# Altium project LDP_PWR_V2.0.PrjPcb
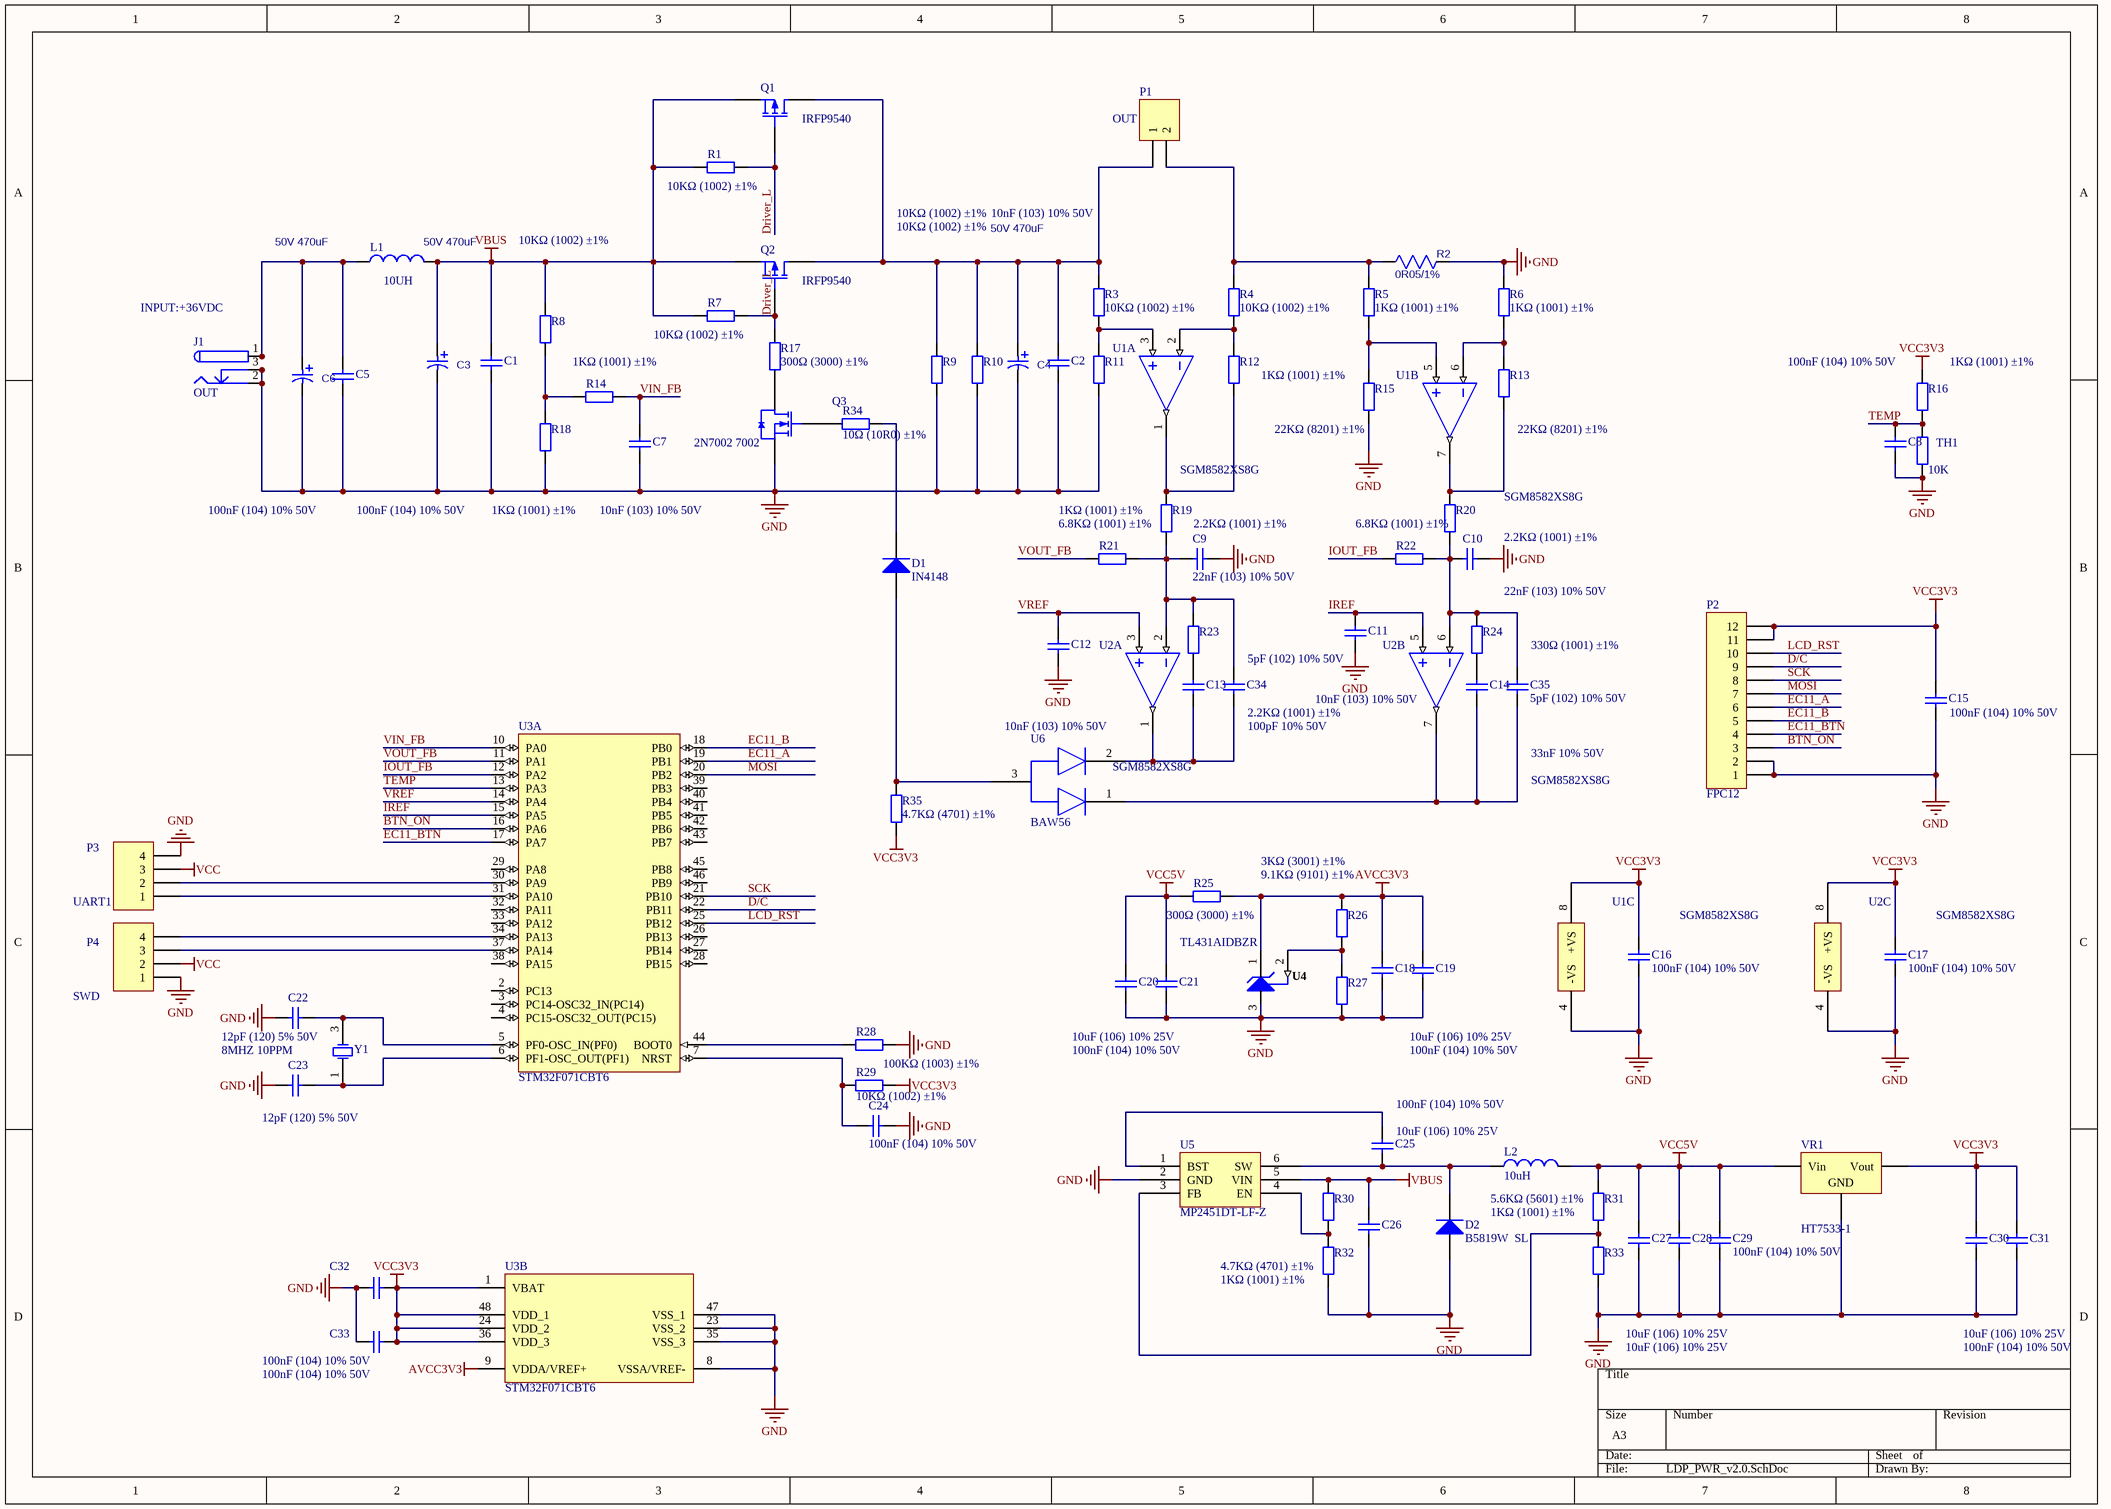
[diagram p0: LDP_PWR_v2.0.SchDoc]
1 sheet, 91 parts. Net scope: global (net labels, ports and power ports of the same name join across sheets).
Board file: LDP_PWR_V2.0.PcbDoc

## Sheet LDP_PWR_v2.0.SchDoc
size A3

### Parts
C1  100nF (104) 10% 50V  [0603_C]
C2  10nF (103) 10% 50V  [0603_C]
C3  50V 470uF  [CAP/DIP/10-5]
C4  50V 470uF  [CAP/DIP/10-5]
C5  100nF (104) 10% 50V  [0603_C]
C6  50V 470uF  [CAP/DIP/10-5]
C7  10nF (103) 10% 50V  [0603_C]
C8  100nF (104) 10% 50V  [0603_C]
C9  22nF (103) 10% 50V  [0603_C]
C10  22nF (103) 10% 50V  [0603_C]
C11  10nF (103) 10% 50V  [0603_C]
C12  10nF (103) 10% 50V  [0603_C]
C13  100pF 10% 50V  [0603_C]
C14  33nF 10% 50V  [0603_C]
C15  100nF (104) 10% 50V  [0603_C]
C16  100nF (104) 10% 50V  [0603_C]
C17  100nF (104) 10% 50V  [0603_C]
C18  10uF (106) 10% 25V  [0805_C]
C19  100nF (104) 10% 50V  [0603_C]
C20  10uF (106) 10% 25V  [0805_C]
C21  100nF (104) 10% 50V  [0603_C]
C22  12pF (120) 5% 50V  [0603_C]
C23  12pF (120) 5% 50V  [0603_C]
C24  100nF (104) 10% 50V  [0603_C]
C25  100nF (104) 10% 50V  [0603_C]
C26  10uF (106) 10% 25V  [0805_C]
C27  10uF (106) 10% 25V  [0805_C]
C28  10uF (106) 10% 25V  [0805_C]
C29  100nF (104) 10% 50V  [0603_C]
C30  10uF (106) 10% 25V  [0805_C]
C31  100nF (104) 10% 50V  [0603_C]
C32  100nF (104) 10% 50V  [0603_C]
C33  100nF (104) 10% 50V  [0603_C]
C34  5pF (102) 10% 50V  [0603_C]
C35  5pF (102) 10% 50V  [0603_C]
D1  IN4148  [SOD-123]
D2  B5819W  SL  [SOD-123]
J1  OUT  [CH3.96]
L1  value 10UH  [L/DIP_6X25]  (hidden comment: Inductor)
L2  10uH  [CD43 - duplicate]
P1  OUT  [CH3.96]
P2  FPC12  [FPC_12]
P3  UART1  [HDR1X4]
P4  SWD  [HDR1X4]
Q1  IRFP9540  [TO-220(TO-220-3)]
Q2  IRFP9540  [TO-220(TO-220-3)]
Q3  2N7002 7002  [SOT-23(SOT-23-3)]
R1  10KΩ (1002) ±1%  [1206_R]
R2  value 0R05/1%  [2512_R]  (hidden comment: 0R05)
R3  10KΩ (1002) ±1%  [0603_R]
R4  10KΩ (1002) ±1%  [0603_R]
R5  1KΩ (1001) ±1%  [0603_R]
R6  1KΩ (1001) ±1%  [0603_R]
R7  10KΩ (1002) ±1%  [1206_R]
R8  10KΩ (1002) ±1%  [0603_R]
R9  10KΩ (1002) ±1%  [1206_R]
R10  10KΩ (1002) ±1%  [1206_R]
R11  1KΩ (1001) ±1%  [0603_R]
R12  1KΩ (1001) ±1%  [0603_R]
R13  22KΩ (8201) ±1%  [0603_R]
R14  1KΩ (1001) ±1%  [0603_R]
R15  22KΩ (8201) ±1%  [0603_R]
R16  1KΩ (1001) ±1%  [0603_R]
R17  300Ω (3000) ±1%  [1206_R]
R18  1KΩ (1001) ±1%  [0603_R]
R19  2.2KΩ (1001) ±1%  [0603_R]
R20  2.2KΩ (1001) ±1%  [0603_R]
R21  6.8KΩ (1001) ±1%  [0603_R]
R22  6.8KΩ (1001) ±1%  [0603_R]
R23  2.2KΩ (1001) ±1%  [0603_R]
R24  330Ω (1001) ±1%  [0603_R]
R25  300Ω (3000) ±1%  [1206_R]
R26  3KΩ (3001) ±1%  [0603_R]
R27  9.1KΩ (9101) ±1%  [0603_R]
R28  100KΩ (1003) ±1%  [0603_R]
R29  10KΩ (1002) ±1%  [0603_R]
R30  4.7KΩ (4701) ±1%  [0603_R]
R31  5.6KΩ (5601) ±1%  [0603_R]
R32  1KΩ (1001) ±1%  [0603_R]
R33  1KΩ (1001) ±1%  [0603_R]
R34  10Ω (10R0) ±1%  [0603_R]
R35  4.7KΩ (4701) ±1%  [0603_R]
TH1  value 10K  [NTC_2.5MM]  (hidden comment: NTC 10K)
U1  SGM8582XS8G  [SOIC-8_208mil]  (parts A,B,C of 3)
U2  SGM8582XS8G  [SOIC-8_208mil]  (parts A,B,C of 3)
U3  STM32F071CBT6  [STM-LQFP48_N]  (parts A,B of 2)
U4  TL431AIDBZR  [TI-DBZ3_N]
U5  MP2451DT-LF-Z  [SOT-23-6]
U6  BAW56  [SOT-23(SOT-23-3)]
VR1  HT7533-1  [SOT-89(SOT-89-3)]
Y1  8MHZ 10PPM  [SMD-3225_4P]

### Nets
AVCC3V3: C18.2 C19.2 R25.2 R26.2 U3.9(VDDA/VREF+) U4.1(CATHODE)
GND: C1.1 C2.2 C3.2 C4.2 C5.1 C6.2 C7.1 C8.1 C9.1 C10.1 C11.2 C12.2 C15.1 C16.1 C17.1 C18.1 C19.1 C20.1 C21.1 C22.1 C23.1 C24.2 C26.1 C27.1 C28.1 C29.1 C30.1 C31.1 C32.2 C33.2 D2.1(A) J1.2 J1.2A J1.2B J1.3 J1.3A J1.3B P2.1 P2.2 P3.4 P4.1 Q3.2(S) R2.1 R6.2 R9.1 R10.1 R11.1 R15.1 R18.1 R27.1 R28.2 R32.1 R33.1 TH1.1 U1.4(-VS) U2.4(-VS) U3.8(VSSA/VREF-) U3.23(VSS_2) U3.35(VSS_3) U3.47(VSS_1) U4.3(ANODE) U5.2(GND) VR1.1(GND)
VBUS: C1.2 C3.1 C26.2 L1.2 Q1.3(S) Q2.3(S) R1.1 R7.1 R8.2 R30.2 U5.5(VIN)
VCC: P3.3 P4.2
VCC3V3: C15.2 C16.2 C17.2 C30.2 C31.2 C32.1 C33.1 P2.11 P2.12 R16.2 R29.2 R35.1 U1.8(+VS) U2.8(+VS) U3.1(VBAT) U3.24(VDD_2) U3.36(VDD_3) U3.48(VDD_1) VR1.3(Vout)
VCC5V: C20.2 C21.2 C27.2 C28.2 C29.2 L2.2 R25.1 R31.2 VR1.2(Vin)
BTN_ON: P2.3 U3.16(PA6)
D/C: P2.9 U3.22(PB11)
Driver_L: Q1.2(G) Q2.2(G) R1.2 R7.2 R17.2
EC11_A: P2.6 U3.19(PB1)
EC11_B: P2.5 U3.18(PB0)
EC11_BTN: P2.4 U3.17(PA7)
IOUT_FB: R22.2 U3.12(PA2)
IREF: C11.1 U2.5(IN+) U3.15(PA5)
LCD_RST: P2.10 U3.25(PB12)
MOSI: P2.7 U3.20(PB2)
SCK: P2.8 U3.21(PB10)
TEMP: C8.2 R16.1 TH1.2 U3.13(PA3)
VIN_FB: C7.2 R14.1 U3.10(PA0)
VOUT_FB: R21.2 U3.11(PA1)
VREF: C12.1 U2.3(IN+) U3.14(PA4)
NetC2_1: C2.1 C4.1 P1.1 Q1.1(D) Q2.1(D) R3.2 R9.2 R10.2
NetC5_2: C5.2 C6.1 J1.1 J1.1B J1.2 L1.1
NetC9_2: C9.2 C34.2 R19.1 R21.1 R23.1 U2.2(IN-)
NetC10_2: C10.2 C35.2 R20.1 R22.1 R24.1 U2.6(IN-)
NetC13_1: C13.1 R23.2
NetC13_2: C13.2 C34.1 U2.1(OUT)
NetC14_1: C14.1 R24.2
NetC14_2: C14.2 C35.1 U2.7(OUT)
NetC22_2: C22.2 U3.5(PF0-OSC_IN(PF0)) Y1.3(OSC2)
NetC23_2: C23.2 U3.6(PF1-OSC_OUT(PF1)) Y1.1(OSC1)
NetC24_1: C24.1 R29.1 U3.7(NRST)
NetC25_1: C25.1 D2.2(K) L2.1 U5.6(SW)
NetC25_2: C25.2 U5.1(BST)
NetD1_1: D1.1(A) R35.2 U6.3
NetD1_2: D1.2(K) R34.2
NetP1_2: P1.2 R2.2 R4.2 R5.2
NetP3_1: P3.1 U3.31(PA10)
NetP3_2: P3.2 U3.30(PA9)
NetP4_3: P4.3 U3.37(PA14)
NetP4_4: P4.4 U3.34(PA13)
NetQ3_1: Q3.1(G) R34.1
NetQ3_3: Q3.3(D) R17.1
NetR3_1: R3.1 R11.2 U1.3(IN+)
NetR4_1: R4.1 R12.2 U1.2(IN-)
NetR5_1: R5.1 R15.2 U1.5(IN+)
NetR6_1: R6.1 R13.2 U1.6(IN-)
NetR8_1: R8.1 R14.2 R18.2
NetR12_1: R12.1 R19.2 U1.1(OUT)
NetR13_1: R13.1 R20.2 U1.7(OUT)
NetR26_1: R26.1 R27.2 U4.2(REF)
NetR28_1: R28.1 U3.44(BOOT0)
NetR30_1: R30.1 R32.2 U5.4(EN)
NetR31_1: R31.1 R33.2 U5.3(FB)

Not connected (* = marked no-connect by the designer): U3 2(PC13) 3(PC14-OSC32_IN(PC14)) 4(PC15-OSC32_OUT(PC15)) 26(PB13) 27(PB14) 28(PB15) 29(PA8) 32(PA11) 33(PA12) 38(PA15) 39(PB3) 40(PB4) 41(PB5) 42(PB6) 43(PB7) 45(PB8) 46(PB9); U6 1 2

### Notes on the sheet
- (near J1) INPUT:+36VDC

### Library data of the parts
C1 C5 C8 C15-C17 C19 C21 C24 C25 C29 C31-C33 = 0603 100nF (104) 10% 50V: 贴片电容; ComponentLink1Description: 供应商链接; ComponentLink1URL: http://www.szlcsc.com/product/details_15331.html; Package: 0603; Supplier: LC; SuppliersPartNumber: C14663
C2 C7 C9-C14 = 0603 10nF (103) 10% 50V: 贴片电容; ComponentLink1Description: 供应商链接; ComponentLink1URL: http://www.szlcsc.com/product/details_58143.html; Package: 0603; Supplier: LC; SuppliersPartNumber: C57112
C3 C4 C6 = 07.0686: Capacitor;400V;20%; Manufacturer: {Manufacturer}; Manufacturer P/N: {Manufacturer P/N}; Part_Name: EKXG401ELL470ML25S; Manufacture: Nippon Chemi-con; Value: 220uF; Pid: 2107; Out_Num: 0; Available_Num: 67; EPR_Note: 16*25脚距7.5; Note: 47uF/400V; Package: DIP; Part Number: 07.0686; Spec: Capacitor; Manufacture_PN: EKXG401ELL470ML25S; Stock_Num: 67
C18 C20 C26-C28 C30 = 0805 10uF (106) 10% 25V: 贴片电容; ComponentLink1Description: 供应商链接; ComponentLink1URL: http://www.szlcsc.com/product/details_16532.html; Package: 0805; Supplier: LC; SuppliersPartNumber: C15850
C22 C23 = 0603 12pF (120) 5% 50V: 贴片电容; ComponentLink1Description: 供应商链接; ComponentLink1URL: http://www.szlcsc.com/product/details_39506.html; Package: 0603; Supplier: LC; SuppliersPartNumber: C38523
C34 C35 = 0603 1nF (102) 10% 50V: 贴片电容; ComponentLink1Description: 供应商链接; ComponentLink1URL: http://www.szlcsc.com/product/details_1940.html; Package: 0603; Supplier: LC; SuppliersPartNumber: C1588
D1 = Diode: Default Diode; Published: 8-Jun-2000; LatestRevisionDate: 17-Jul-2002; LatestRevisionNote: Re-released for DXP Platform.; PackageVersion: Sep-1996; PackageReference: SMC; Publisher: Altium Limited; PackageDescription: DO-214-AB/SMC; 2 C-Bend Leads; Body 7.9 x 5.9 mm, inc. leads (LxW); Code_JEDEC: DO-214-AB
D2 = SOD-123 B5819W  SL: 肖特基二极管; ComponentLink1Description: 供应商链接; ComponentLink1URL: http://www.szlcsc.com/product/details_9093.html; Package: SOD-123; Supplier: LC; SuppliersPartNumber: C8598
J1 = PWR2.5: Low Voltage Power Supply Connector; Published: 17-Dec-2003; DatasheetDocument: 09-May-2002; Publisher: Altium Limited; ComponentLink1Description: Manufacturer Link; ComponentLink1URL: http://domino.kycon.com/internet/Products.html
L1 L2 = Inductor: Code_IEC: 1005; Published: 8-Jun-2000; LatestRevisionDate: 29-May-2009; LatestRevisionNote: IPC-7351 Footprint Added.; PackageReference: 0402-A; Publisher: Altium Limited; PackageDescription: Chip Inductor; Code_JEITA: 0402
  L2: Value: 10uH
P1 = Header 2: Header, 2-Pin; LatestRevisionDate: 17-Jul-2002; LatestRevisionNote: Re-released for DXP Platform.; Publisher: Altium Limited
P2 = Header 12: Header, 12-Pin; LatestRevisionDate: 17-Jul-2002; LatestRevisionNote: Re-released for DXP Platform.; Publisher: Altium Limited
P3 P4 = Header 4: Header, 4-Pin; LatestRevisionDate: 17-Jul-2002; LatestRevisionNote: Re-released for DXP Platform.; Publisher: Altium Limited
Q1 Q2 = MOSFET-P: P-Channel MOSFET; Published: 8-Jun-2000; LatestRevisionDate: 17-Jul-2002; LatestRevisionNote: Re-released for DXP Platform.; PackageVersion: 1995/1996; PackageReference: E3; Publisher: Altium Limited; PackageDescription: TO, Flat Index; 3 In-Line, Axial Leads; Body Dia. 4.6mm; Lead Dia. 0.5 mm (max)
Q3 = 2N7002 7002: MOS(场效应管); ComponentLink1Description: 供应商链接; ComponentLink1URL: http://www.szlcsc.com/product/details_9040.html; Package: SOT-23(SOT-23-3); Supplier: LC; SuppliersPartNumber: C8545
R1 R7 R9 R10 = 1206 10KΩ (1002) 1%: 贴片电阻; ComponentLink1Description: 供应商链接; ComponentLink1URL: http://www.szlcsc.com/product/details_18590.html; Package: 1206; Supplier: LC; SuppliersPartNumber: C17902
R2 = 06.0281: Film Resistor;5%;; Manufacturer: Yageo; Manufacturer P/N: 9C06031A1203FKHFT; Part_Name: 0603SAJ0102T5E; Pid: 1965; Out_Num: 0; Available_Num: 8849; Package: 0603; Distributor: Digikey; Distributor P/N: 311-120KHCT-ND; Part Number: 06.0281; Spec: Film Resistor; Manufacture_PN: 0603SAJ0102T5E; Stock_Num: 8849
R3 R4 R8 R29 = 0603 10KΩ (1002) 1%: 贴片电阻; ComponentLink1Description: 供应商链接; ComponentLink1URL: http://www.szlcsc.com/product/details_26547.html; Package: 0603; Supplier: LC; SuppliersPartNumber: C25804
R5 R6 R11 R12 R14 R16 R18-R24 R32 R33 = 0603 1KΩ (1001) 1%: 贴片电阻; ComponentLink1Description: 供应商链接; ComponentLink1URL: http://www.szlcsc.com/product/details_21904.html; Package: 0603; Supplier: LC; SuppliersPartNumber: C21190
R13 R15 = 0603 8.2KΩ (8201) 1%: 贴片电阻; ComponentLink1Description: 供应商链接; ComponentLink1URL: http://www.szlcsc.com/product/details_26724.html; Package: 0603; Supplier: LC; SuppliersPartNumber: C25981
R17 R25 = 1206 300Ω (3000) 1%: 贴片电阻; ComponentLink1Description: 供应商链接; ComponentLink1URL: http://www.szlcsc.com/product/details_18575.html; Package: 1206; Supplier: LC; SuppliersPartNumber: C17887
R26 = 0603 3KΩ (3001) 1%: 贴片电阻; ComponentLink1Description: 供应商链接; ComponentLink1URL: http://www.szlcsc.com/product/details_4618.html; Package: 0603; Supplier: LC; SuppliersPartNumber: C4211
R27 = 0603 9.1KΩ (9101) 1%: 贴片电阻; ComponentLink1Description: 供应商链接; ComponentLink1URL: http://www.szlcsc.com/product/details_23987.html; Package: 0603; Supplier: LC; SuppliersPartNumber: C23260
R28 = 0603 100KΩ (1003) 1%: 贴片电阻; ComponentLink1Description: 供应商链接; ComponentLink1URL: http://www.szlcsc.com/product/details_26546.html; Package: 0603; Supplier: LC; SuppliersPartNumber: C25803
R30 R35 = 0603 4.7KΩ (4701) 1%: 贴片电阻; ComponentLink1Description: 供应商链接; ComponentLink1URL: http://www.szlcsc.com/product/details_23889.html; Package: 0603; Supplier: LC; SuppliersPartNumber: C23162
R31 = 0603 5.6KΩ (5601) 1%: 贴片电阻; ComponentLink1Description: 供应商链接; ComponentLink1URL: http://www.szlcsc.com/product/details_23916.html; Package: 0603; Supplier: LC; SuppliersPartNumber: C23189
R34 = 0603 10Ω (10R0) 1%: 贴片电阻; ComponentLink1Description: 供应商链接; ComponentLink1URL: http://www.szlcsc.com/product/details_23586.html; Package: 0603; Supplier: LC; SuppliersPartNumber: C22859
TH1 = Res2: Resistor; Published: 8-Jun-2000; LatestRevisionDate: 17-Jul-2002; LatestRevisionNote: Re-released for DXP Platform.; PackageReference: AXIAL-0.4; Publisher: Altium Limited; PackageDescription: Axial Device, Thru-Hole; 2 Leads; 0.4 in Pin Spacing
U1 U2 = SGM8292XS8G: 运放; ComponentLink1Description: 供应商链接; ComponentLink1URL: http://www.szlcsc.com/product/details_8449.html; Package: SOT-23-5; Supplier: LC; SuppliersPartNumber: C7972
U3 = STM32F303CCT6: ARM Cortex-M4 32-bit MCU, 256 KB Flash, 40 KB Internal RAM, 37 I/Os, 48-pin LQFP, -40 to 85 degC, Tray; D/A Converter: 2x12-bit (2 Channel); FLASH Size (Prog) (kB): 256; I/Os (High Current): 37; Internal RAM Size (kB): 40; Operating Frequency(F) (Processor speed) (MHz): 72; Supply Voltage(Vcc) min (V): 2; DatasheetVersion: Rev. 6; PackageVersion: Rev. 6, 06/2013; PackageReference: LQFP48; PackageDescription: 48-Pin Low Profile Quad Flat Package, 7 x 7 mm Body, 0.5 mm Pitch; Supplier 1: Digi-Key; Supplier Part Number 1: 497-13318-ND; Supplier 2: Newark; Supplier Part Number 2: 46W2192; Supplier 3: Newark; Supplier Part Number 3: 66W7286; Supplier 4: Mouser; Supplier Part Number 4: 511-STM32F303CCT6; Core: ARM Cortex-M4; Packing: Tray; Mounting Technology: Surface Mount; PartNumber: STM32F303CCT6; ComponentLink1Description: Manufacturer URL; ComponentLink1URL: http://www.st.com/web/en/home.html; ComponentLink2Description: Datasheet; ComponentLink2URL: http://www.st.com/st-web-ui/static/active/en/resource/technical/document/datasheet/DM00058181.pdf; ComponentLink3Description: Package Specification; ComponentLink3URL: http://www.st.com/st-web-ui/static/active/en/resource/technical/document/datasheet/DM00058181.pdf
U4 = TL431AIDBZR: Adjustable Precision Shunt Regulator, 34 ppm / degC, 100 mA, -40 to 85 degC, 3-pin SOT-23 (DBZ), Green (RoHS & no Sb/Br); Manufacturer: Texas Instruments; Initial Accuracy @ 25/deg C(%): 1; Iout/Iz(Max)(mA): 100; Min Iz for Regulation(uA): 600; Rating: Catalog; SubFamily: Shunt Voltage Reference; Temp Coeff(Max)(ppm/ degree C): 92; Temp Coeff(Typ)(ppm/ degree C): 34; VO Adj(Max)(V): 36; VO Adj(Min)(V): 2.495; DatasheetVersion: SLVS543M; PackageVersion: 4203227/B; PackageReference: DBZ3; PackageDescription: 3-Pin Plastic Small Outline, Body 2.92 x 1.3 mm, Pitch 0.95 mm; Supplier 1: Digi-Key; Supplier Part Number 1: 296-17329-2-ND; Supplier 2: Digi-Key; Supplier Part Number 2: 296-17329-1-ND; Supplier 3: Digi-Key; Supplier Part Number 3: 296-17329-6-ND; Supplier 4: Farnell; Supplier Part Number 4: 1411108; Supplier 5: Newark; Supplier Part Number 5: 44J2371; Supplier 6: Mouser; Supplier Part Number 6: 595-TL431AIDBZR; Eco-Plan: Green (RoHS & no Sb/Br); Mounting Technology: Surface Mount; Code_JEDEC: TO-236; PartNumber: TL431AIDBZR; ComponentLink1Description: Manufacturer URL; ComponentLink1URL: http://www.ti.com/; ComponentLink2Description: Datasheet; ComponentLink2URL: http://www.ti.com/general/docs/lit/getliterature.tsp?genericPartNumber=TL431A&fileType=pdf; ComponentLink3Description: Package Specification; ComponentLink3URL: http://www.ti.com/litv/pdf/mpds108a
U5 = MP2451DT-LF-Z_[C14123]: DC-DC芯片; ComponentLink1Description: 供应商链接; ComponentLink1URL: http://www.szlcsc.com/product/details_14780.html; Package: SOT-23-6; Supplier: LC; SuppliersPartNumber: C14123
VR1 = SOT-89 HT7533-1: 低压差线性稳压(LDO); ComponentLink1Description: 供应商链接; ComponentLink1URL: http://www.szlcsc.com/product/details_14949.html; Package: SOT-89; Supplier: LC; SuppliersPartNumber: C14289
Y1 = SMD-3225_4P  12MHZ 20PF 10PPM: 贴片晶振; ComponentLink1Description: 供应商链接; ComponentLink1URL: http://www.szlcsc.com/product/details_9522.html; Package: SMD-3225_4P; Supplier: LC; SuppliersPartNumber: C9002